# EAGLE design MBC5_1-4 (EAGLE 9.6.2)
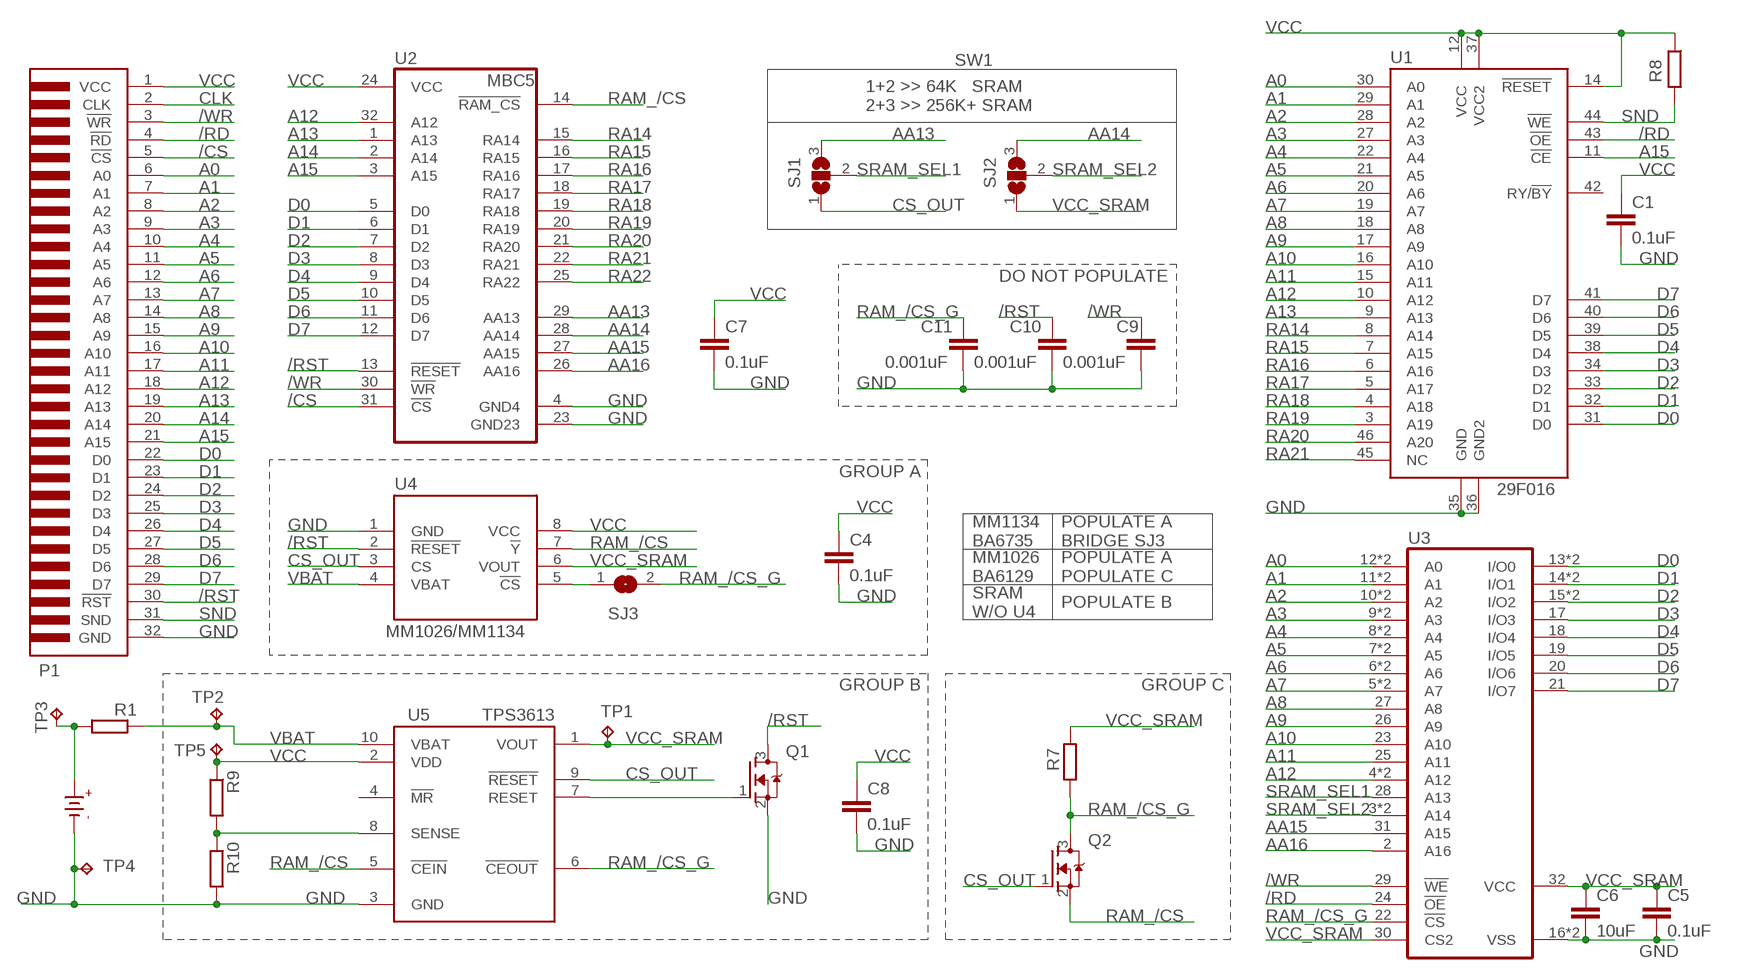
[diagram p0: schematic, sheet 1]

## Parts
B1  CR2025  [CR2025]
C1  0.1uF  C-EUC0603  [C0603]
C4  0.1uF  C-EUC0603  [C0603]
C5  0.1uF  C-EUC0603  [C0603]
C6  10uF  C-EUC0603  [C0603]
C7  0.1uF  C-EUC0603  [C0603]
C8  0.1uF  C-EUC0603  [C0603]
C9  0.001uF  C-EUC0603  [C0603]
C10  0.001uF  C-EUC0603  [C0603]
C11  0.001uF  C-EUC0603  [C0603]
P1  GBC_CARTTAB  [GBC_CART_TABBED]
Q1  2N7002  MOSFET-NREFLOW  [SOT23]
Q2  2N7002  MOSFET-NREFLOW  [SOT23]
R1  RR0603  [R0603]
R7  RR0603  [R0603]
R8  RR0603  [R0603]
R9  RR0603  [R0603]
R10  RR0603  [R0603]
SJ1  SJ2W  [SJ_2]
SJ2  SJ2W  [SJ_2]
SJ3  SJ  [SJ]
TP1  TPB1,27  [B1,27]
TP2  TPB1,27  [B1,27]
TP3  TPB1,27  [B1,27]
TP4  TPB1,27  [B1,27]
TP5  TPB1,27  [B1,27]
U1  29F016  [TSOP-48]
U2  MBC5  [QFP-32]
U3  1008L  [SO32L_L]
U4  MM1134  [SOIC-8]
U5  TPS3613  [MSOP-10]

## Nets
/CS: P1.5(!CS) U2.31(!CS)
/RD: P1.4(!RD) U1.43(!OE) U3.24(!OE)
/RST: C10.1 P1.30(!RST) Q1.3(D) U2.13(!RESET) U4.2(!RESET)
/WR: C9.1 P1.3(!WR) U2.30(!WR) U3.29(!WE)
A0: P1.6(A0) U1.30(A0) U3.12(A0) U3.L12(A0)
A1: P1.7(A1) U1.29(A1) U3.11(A1) U3.L11(A1)
A2: P1.8(A2) U1.28(A2) U3.10(A2) U3.L10(A2)
A3: P1.9(A3) U1.27(A3) U3.9(A3) U3.L9(A3)
A4: P1.10(A4) U1.22(A4) U3.8(A4) U3.L8(A4)
A5: P1.11(A5) U1.21(A5) U3.7(A5) U3.L7(A5)
A6: P1.12(A6) U1.20(A6) U3.6(A6) U3.L6(A6)
A7: P1.13(A7) U1.19(A7) U3.5(A7) U3.L5(A7)
A8: P1.14(A8) U1.18(A8) U3.27(A8)
A9: P1.15(A9) U1.17(A9) U3.26(A9)
A10: P1.16(A10) U1.16(A10) U3.23(A10)
A11: P1.17(A11) U1.15(A11) U3.25(A11)
A12: P1.18(A12) U1.10(A12) U2.32(A12) U3.4(A12) U3.L4(A12)
A13: P1.19(A13) U1.9(A13) U2.1(A13)
A14: P1.20(A14) U2.2(A14)
A15: P1.21(A15) U1.11(!CE) U2.3(A15)
AA13: SJ1.3 U2.29(AA13)
AA14: SJ2.3 U2.28(AA14)
AA15: U2.27(AA15) U3.31(A15)
AA16: U2.26(AA16) U3.2(A16)
CLK: P1.2(CLK)
CS_OUT: Q2.1(G) SJ1.1 U4.3(CS) U5.9(!RESET)
D0: P1.22(D0) U1.31(D0) U2.5(D0) U3.13(I/O0) U3.L13(I/O0)
D1: P1.23(D1) U1.32(D1) U2.6(D1) U3.14(I/O1) U3.L14(I/O1)
D2: P1.24(D2) U1.33(D2) U2.7(D2) U3.15(I/O2) U3.L15(I/O2)
D3: P1.25(D3) U1.34(D3) U2.8(D3) U3.17(I/O3)
D4: P1.26(D4) U1.38(D4) U2.9(D4) U3.18(I/O4)
D5: P1.27(D5) U1.39(D5) U2.10(D5) U3.19(I/O5)
D6: P1.28(D6) U1.40(D6) U2.11(D6) U3.20(I/O6)
D7: P1.29(D7) U1.41(D7) U2.12(D7) U3.21(I/O7)
GND [GND]: B1.- C1.2 C4.2 C5.2 C6.2 C7.2 C8.2 C9.2 C10.2 C11.2 P1.32(GND) Q1.2(S) R10.2 TP4.TP U1.35(GND) U1.36(GND2) U2.4(GND4) U2.23(GND23) U3.16(VSS) U3.L16(VSS) U4.1(GND) U5.3(GND)
N$3 [VCC]: B1.+ R1.2 TP3.TP
N$4: SJ3.1 U4.5(!CS)
N$6: Q1.1(G) U5.7(RESET)
N$7: R9.2 R10.1 U5.8(SENSE)
RA14: U1.8(A14) U2.15(RA14)
RA15: U1.7(A15) U2.16(RA15)
RA16: U1.6(A16) U2.17(RA16)
RA17: U1.5(A17) U2.18(RA17)
RA18: U1.4(A18) U2.19(RA18)
RA19: U1.3(A19) U2.20(RA19)
RA20: U1.46(A20) U2.21(RA20)
RA21: U1.45(NC) U2.22(RA21)
RA22: U2.25(RA22)
RAM_/CS: Q2.2(S) U2.14(!RAM_CS) U4.7(!Y) U5.5(!CEIN)
RAM_/CS_G: C11.1 Q2.3(D) R7.1 SJ3.2 U3.22(!CS) U5.6(!CEOUT)
SND: P1.31(SND) R8.2 U1.44(!WE)
SRAM_SEL1: SJ1.2 U3.28(A13)
SRAM_SEL2: SJ2.2 U3.3(A14) U3.L3(A14)
VBAT [VCC]: R1.1 TP2.TP U4.4(VBAT) U5.10(VBAT)
VCC [VCC]: C1.1 C4.1 C7.1 C8.1 P1.1(VCC) R8.1 R9.1 TP5.TP U1.12(VCC) U1.14(!RESET) U1.37(VCC2) U2.24(VCC) U4.8(VCC) U5.2(VDD)
VCC_SRAM [VCC]: C5.1 C6.1 R7.2 SJ2.1 TP1.TP U3.30(CS2) U3.32(VCC) U4.6(VOUT) U5.1(VOUT)
Unconnected: U1.42(RY/!BY) U5.4(!MR)

## Notes on the sheet
- SW1
- 1+2 >> 64K   SRAM
  2+3 >> 256K+ SRAM
- DO NOT POPULATE
- GROUP A
- MM1134
  BA6735
- POPULATE A
  BRIDGE SJ3
- MM1026
  BA6129
- POPULATE A
  POPULATE C
- SRAM
  W/O U4
- POPULATE B
- MM1026/MM1134
- GROUP B | GROUP C

## Library data of the parts
B1 = gameboylib:CR2025
C1 C4-C11 = rcl:C-EU: CAPACITOR, European symbol; SPICEPREFIX: C
P1 = gameboylib:GBC_CART
Q1 Q2 = adafruit:MOSFET-N: N-Channel Mosfet 2N7002E - 60V 260mA SOT23 [Digikey: 2N7002ET1GOSTR-ND] - REEL BSH103 - 30V 850mA SOT23 [Digikey: 568-5013-1-ND]
R1 R7-R10 = eagle-ltspice:R: RESISTOR, European symbol; SPICEMODEL: NONE; SPICEPREFIX: R
SJ1 SJ2 = jumper:SJ2W: SMD solder JUMPER
SJ3 = jumper:SJ: SMD solder JUMPER
TP1-TP5 = testpad:TP: Test pad
U1 = gameboylib:29F016
U2 = gameboylib:MBC5: MBC5; OC_FARNELL: unknown; OC_NEWARK: unknown
U3 = gameboylib:1008L: MEMORY
U4 = gameboylib:MM1134
U5 = gameboylib:TPS3613

## Net classes
1 VCC: width 0.203 mm
2 GND: width 0.203 mm

## Board
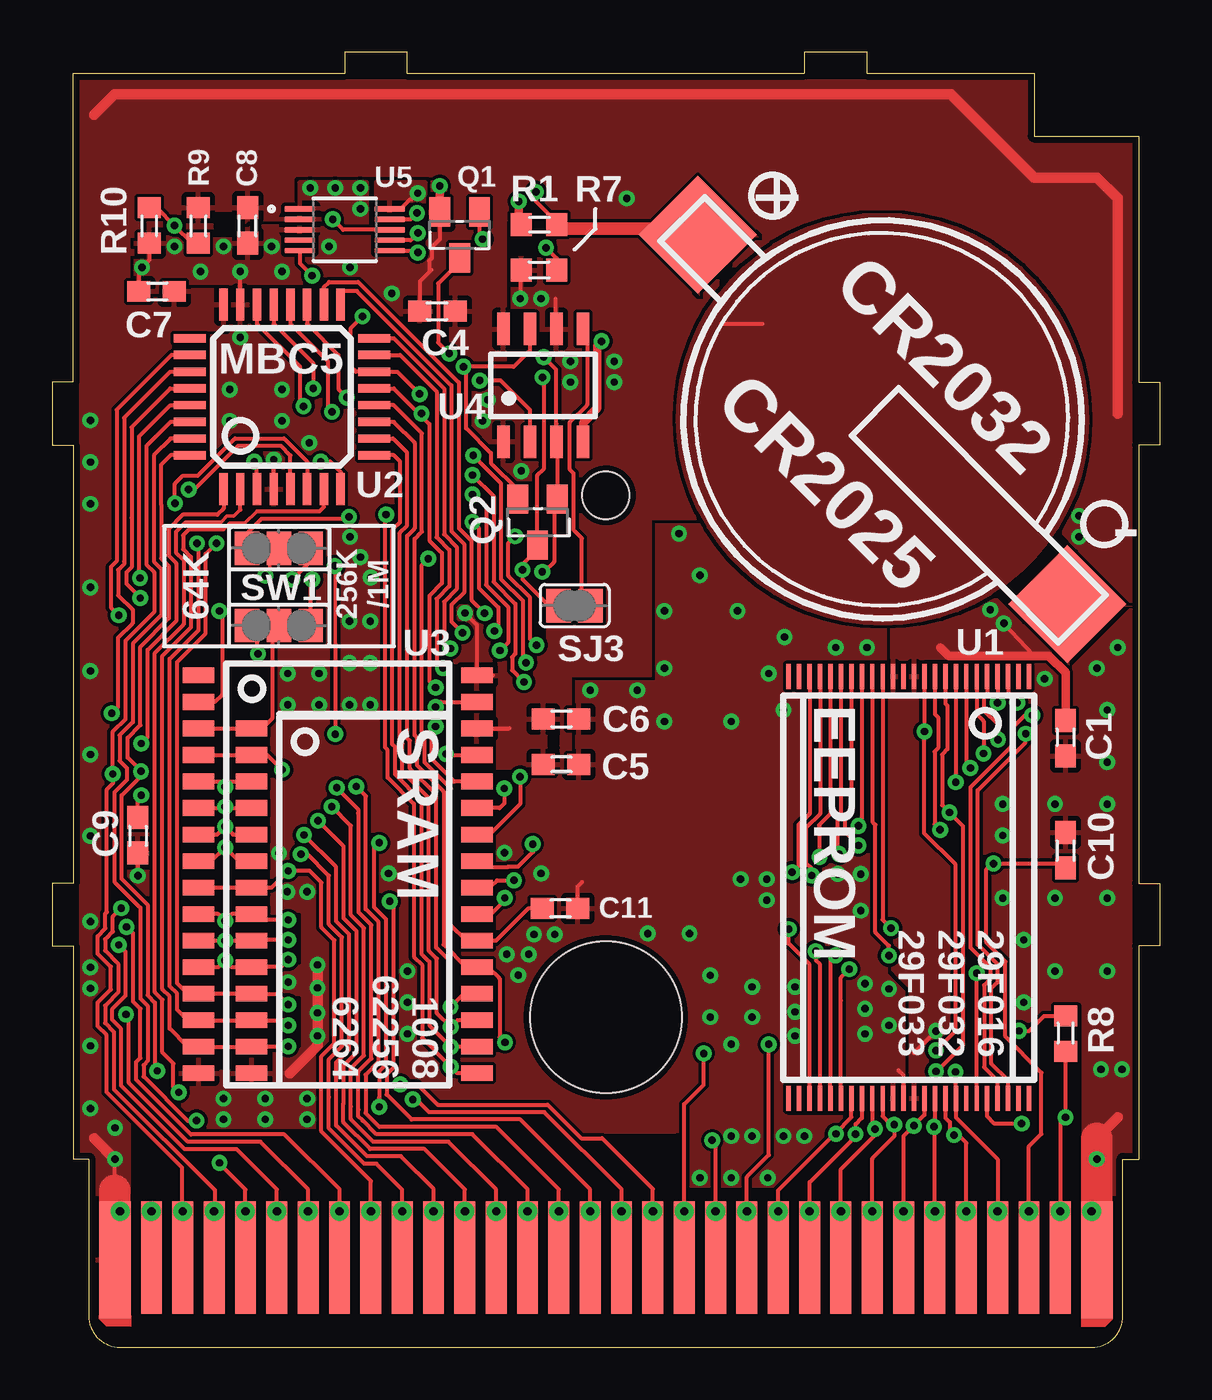
[diagram p1: board, top side]
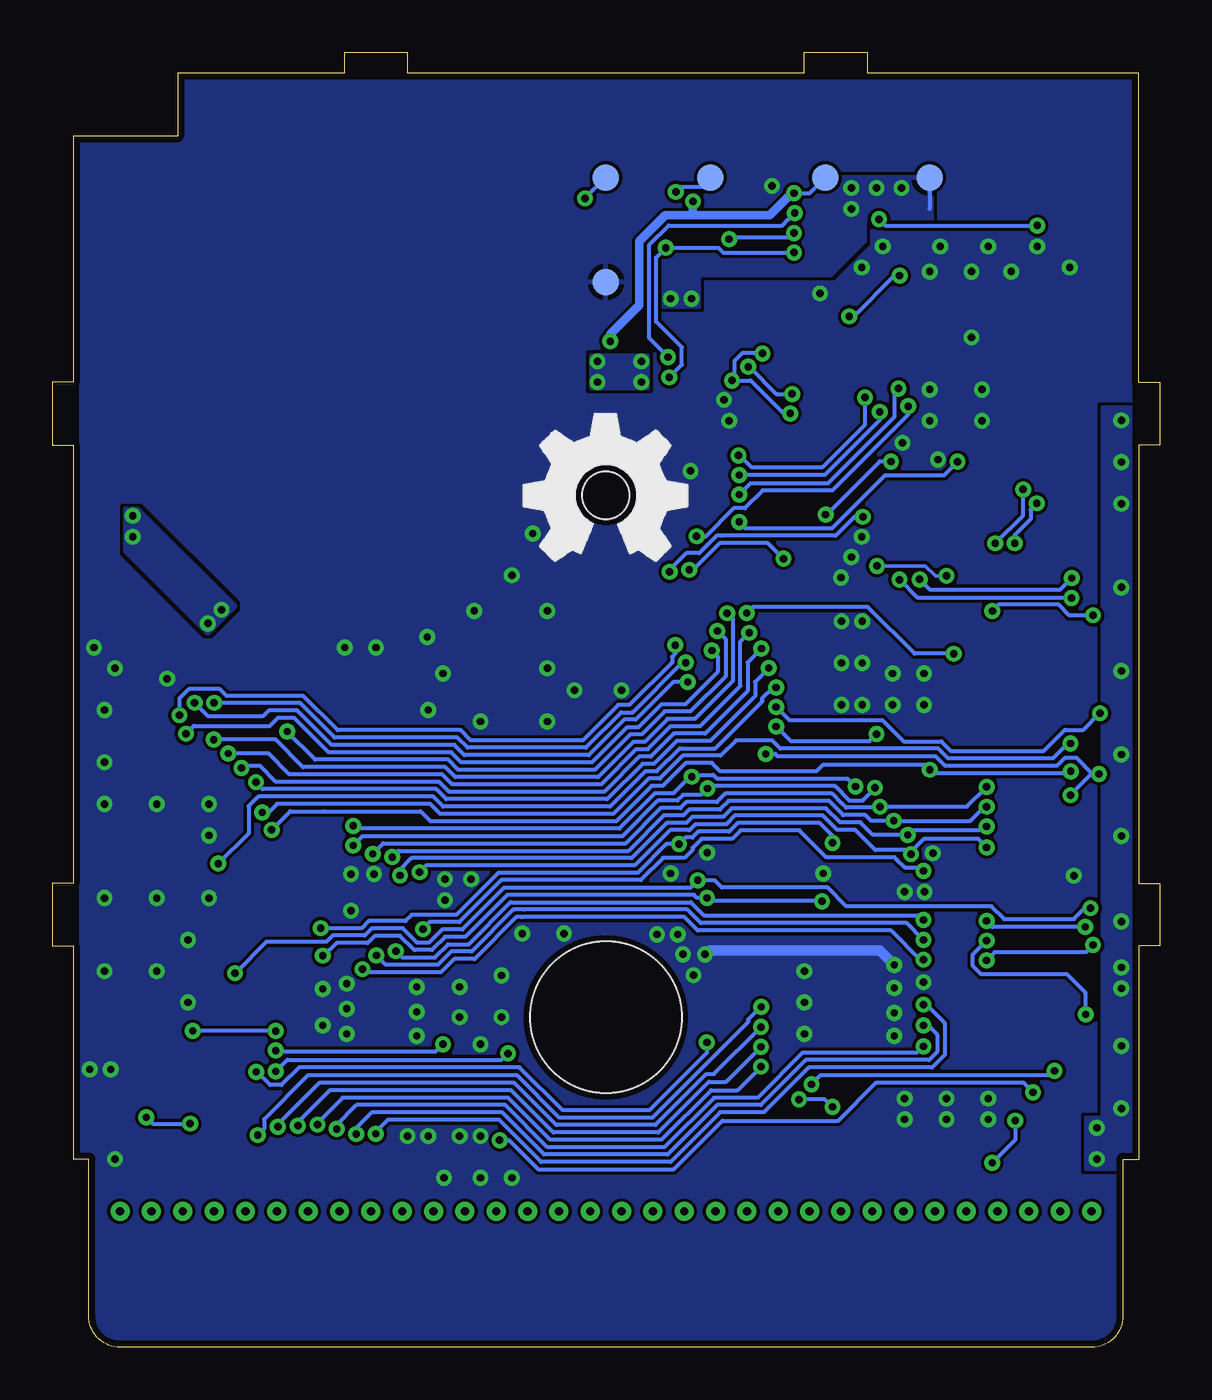
[diagram p2: board, bottom side, seen from below]

Size 53 x 62.01 mm. Coordinates in mm from the lower left corner, seen from the top.
Copper layers (1*16): Top 0.035mm / dielectric 1.5mm / Bottom 0.035mm
Design rules "default *": minimum track width 7mil, minimum drill 13mil, track to track 6mil, track to pad 7mil, pad to pad 7mil, via to via 7mil, smd to smd 5mil, copper to edge 12mil, drill to drill 22mil, minimum pad ring 10mil, minimum via ring 8mil, stop-mask expansion 4mil, vias tented up to drill 14mil, thermal gap 10mil
tKeepout: area -0.8,-1.6 to 55,11.5; area 0,11 to 3,62; area 50,11 to 53,62; area 3,55.1 to 50,62
tRestrict: area 29,6.7 to 34.9,7.6; area 3.9,3.5 to 49.1,7.6; area 11.2,14.4 to 11.8,16.7; area 35.1,11.9 to 40,12.6; area 35.2,32.5 to 39.8,32.8; area 47.6,0.7 to 50.9,1.2; area 41.7,32.5 to 46.8,32.8; area 9.3,50.4 to 12.7,50.8; area 7,42.9 to 7.5,48.4; area 9.9,21 to 10.3,29.4; area 10.1,13.5 to 10.4,14.2; area 8,13.4 to 8.6,13.8; area 19.4,29 to 19.9,32.5; area 20.8,30.2 to 21.1,31.8; area 20.5,23.6 to 21.1,29.2; area 20.8,19.8 to 21.1,20.4; area 22,49.2 to 23.1,49.6; area 35.2,11.2 to 44,11.7; area 48.5,4.6 to 49.1,16.4; area 3.9,7 to 4.5,11.1; area 26.1,9.7 to 29.9,10.2; area 22.8,48.1 to 23.9,48.5; area 11.2,9.9 to 12.8,10.3; area 11.2,18.4 to 11.8,20.7; area 10,17.2 to 10.6,17.9; area 22.2,52.4 to 22.6,52.8; area 7.8,53.3 to 8.6,54.3; area 17.4,48.5 to 17.9,48.9; area 23.1,34.1 to 23.6,34.5; area 23.8,28.7 to 24.2,29.4; area 16.9,54.4 to 17.1,54.5; area 40.5,11.8 to 40.5,12.1; area 45.3,34.7 to 49,38.9; area 10.9,60.8 to 42.9,61.3; area 0.7,15 to 1.2,47; area 51.8,14.7 to 52.3,46.7
bRestrict: area 51.8,14.7 to 52.3,46.7; area 0.7,15 to 1.2,47; area 10.9,60.8 to 42.9,61.3

### Footprints (pad centres in the part's own frame; a part is rotated, then mirrored left to right if it is on the bottom)
CR2025 = smd 4 x 4: + -12,0; - 13,0
C0603 = smd 1.1 x 1: 1 -0.85,0; 2 0.85,0
GBC_CART_TABBED = smd 1.5 x 5.6: 1 -23.4,-25.01; 32 23.6,-25.01 | smd 1 x 5.4: 2 -21.65,-24.91; 3 -20.15,-24.91; 4 -18.65,-24.91; 5 -17.15,-24.91; 6 -15.65,-24.91; 7 -14.15,-24.91; 8 -12.65,-24.91; 9 -11.15,-24.91; 10 -9.65,-24.91; 11 -8.15,-24.91; 12 -6.65,-24.91; 13 -5.15,-24.91; 14 -3.65,-24.91; 15 -2.15,-24.91; 16 -0.65,-24.91; 17 0.85,-24.91; 18 2.35,-24.91; 19 3.85,-24.91; 20 5.35,-24.91; 21 6.85,-24.91; 22 8.35,-24.91; 23 9.85,-24.91; 24 11.35,-24.91; 25 12.85,-24.91; 26 14.35,-24.91; 27 15.85,-24.91; 28 17.35,-24.91; 29 18.85,-24.91; 30 20.35,-24.91; 31 21.85,-24.91 | drill 0.4: P$1 -21.65,-22.7; P$2 -18.65,-22.7; P$3 -15.65,-22.7; P$4 -12.65,-22.7; P$5 -9.65,-22.7; P$6 -6.65,-22.7; P$7 -3.65,-22.7; P$8 -0.65,-22.7; P$9 2.35,-22.7; P$10 5.35,-22.7; P$11 8.35,-22.7; P$12 11.35,-22.7; P$13 14.35,-22.7; P$14 17.35,-22.7; P$15 20.35,-22.7; P$16 23.35,-22.7; P$17 21.85,-22.7; P$18 18.85,-22.7; P$19 15.85,-22.7; P$20 12.85,-22.7; P$21 9.85,-22.7; P$22 6.85,-22.7; P$23 3.85,-22.7; P$24 0.85,-22.7; P$25 -2.15,-22.7; P$26 -5.15,-22.7; P$27 -8.15,-22.7; P$28 -11.15,-22.7; P$29 -14.15,-22.7; P$30 -17.15,-22.7; P$31 -20.15,-22.7; P$32 -23.15,-22.7 | hole 7.25: 0.1,-13.41 | hole 2.25: 0.1,11.585
SOT23 = smd 1 x 1.4: 1 -0.95,-1.1; 2 0.95,-1.1; 3 0,1.1
R0603 = smd 1 x 1.1: 1 -0.85,0; 2 0.85,0
SJ_2 = smd 1.168 x 1.6: 1 -1.524,0; 2 0,0; 3 1.524,0
SJ = smd 1.168 x 1.6: 1 -0.762,0; 2 0.762,0
B1,27 = smd 1.27 x 1.27: TP 0,0
TSOP-48 = smd 1.2 x 0.21: 1 -10.1,5.75; 2 -10.1,5.25; 3 -10.1,4.75; 4 -10.1,4.25; 5 -10.1,3.75; 6 -10.1,3.25; 7 -10.1,2.75; 8 -10.1,2.25; 9 -10.1,1.75; 10 -10.1,1.25; 11 -10.1,0.75; 12 -10.1,0.25; 13 -10.1,-0.25; 14 -10.1,-0.75; 15 -10.1,-1.25; 16 -10.1,-1.75; 17 -10.1,-2.25; 18 -10.1,-2.75; 19 -10.1,-3.25; 20 -10.1,-3.75; 21 -10.1,-4.25; 22 -10.1,-4.75; 23 -10.1,-5.25; 24 -10.1,-5.75; 25 10.1,-5.75; 26 10.1,-5.25; 27 10.1,-4.75; 28 10.1,-4.25; 29 10.1,-3.75; 30 10.1,-3.25; 31 10.1,-2.75; 32 10.1,-2.25; 33 10.1,-1.75; 34 10.1,-1.25; 35 10.1,-0.75; 36 10.1,-0.25; 37 10.1,0.25; 38 10.1,0.75; 39 10.1,1.25; 40 10.1,1.75; 41 10.1,2.25; 42 10.1,2.75; 43 10.1,3.25; 44 10.1,3.75; 45 10.1,4.25; 46 10.1,4.75; 47 10.1,5.25; 48 10.1,5.75
QFP-32 = smd 0.4 x 1.524: 1 -2.8,-4.415; 2 -2,-4.415; 3 -1.2,-4.415; 4 -0.4,-4.415; 5 0.4,-4.415; 6 1.2,-4.415; 7 2,-4.415; 8 2.8,-4.415; 17 2.8,4.415; 18 2,4.415; 19 1.2,4.415; 20 0.4,4.415; 21 -0.4,4.415; 22 -1.2,4.415; 23 -2,4.415; 24 -2.8,4.415 | smd 1.524 x 0.4: 9 4.415,-2.8; 10 4.415,-2; 11 4.415,-1.2; 12 4.415,-0.4; 13 4.415,0.4; 14 4.415,1.2; 15 4.415,2; 16 4.415,2.8; 25 -4.415,2.8; 26 -4.415,2; 27 -4.415,1.2; 28 -4.415,0.4; 29 -4.415,-0.4; 30 -4.415,-1.2; 31 -4.415,-2; 32 -4.415,-2.8
SO32L_L = smd 0.75 x 1.5: 1 -10.16,-7.997; 2 -8.89,-7.997; 3 -7.62,-5.457; 4 -6.35,-5.457; 5 -5.08,-5.457; 6 -3.81,-5.457; 7 -2.54,-5.457; 8 -1.27,-5.457; 9 0,-5.457; 10 1.27,-5.457; 11 2.54,-5.457; 12 3.81,-5.457; 13 5.08,-5.457; 14 6.35,-5.457; 15 7.62,-5.457; 16 8.89,-5.457; 17 8.89,5.33; 18 7.62,5.33; 19 6.35,5.33; 20 5.08,5.33; 21 3.81,5.33; 22 2.54,5.33; 23 1.27,5.33; 24 0,5.33; 25 -1.27,5.33; 26 -2.54,5.33; 27 -3.81,5.33; 28 -5.08,5.33; 29 -6.35,5.33; 30 -7.62,5.33; 31 -8.89,5.33; 32 -10.16,5.33; L3 -7.62,-7.997; L4 -6.35,-7.997; L5 -5.08,-7.997; L6 -3.81,-7.997; L7 -2.54,-7.997; L8 -1.27,-7.997; L9 0,-7.997; L10 1.27,-7.997; L11 2.54,-7.997; L12 3.81,-7.997; L13 5.08,-7.997; L14 6.35,-7.997; L15 7.62,-7.997; L16 8.89,-7.997
SOIC-8 = smd 0.6 x 1.55: 1 1.905,2.7; 2 0.635,2.7; 3 -0.635,2.7; 4 -1.905,2.7; 5 -1.905,-2.7; 6 -0.635,-2.7; 7 0.635,-2.7; 8 1.905,-2.7
MSOP-10 = smd 1.47 x 0.28: 1 -2.15,1; 2 -2.15,0.5; 3 -2.15,0; 4 -2.15,-0.5; 5 -2.15,-1; 6 2.15,-1; 7 2.15,-0.5; 8 2.15,0; 9 2.15,0.5; 10 2.15,1

### Placement (x,y rotation side)
B1  39.39,44.79 315 top
C1  48.5,29.16 270 top
C4  18.45,49.61 180 top
C5  24.35,27.91 0 top
C6  24.35,30.09 0 top
C7  5,50.56 180 top
C8  9.35,53.71 270 top
C9  4.1,24.51 270 top
C10  48.5,23.81 90 top
C11  24.3,21.01 0 top
P1  26.4,29.21 0 top
Q1  19.5,53.26 180 top
Q2  23.23,39.51 180 top
R1  23.3,53.76 0 top
R7  23.3,51.59 180 top
R8  48.5,15.01 270 top
R9  7,53.71 270 top
R10  4.65,53.71 270 top
SJ1  10.85,38.26 0 top
SJ2  10.85,34.56 0 top
SJ3  25,35.51 180 top
TP1  11,56.01 0 bottom
TP2  16,56.01 0 bottom
TP3  21.5,56.01 0 bottom
TP4  26.5,51.01 0 bottom
TP5  26.5,56.01 0 bottom
U1  41,22.01 270 top
U2  11,45.51 0 top
U3  15,22.01 270 top
U4  23.5,46.06 180 top
U5  14,53.51 0 top

### Tracks (layer width: path | path; a pad name or v marks a point on that pad's centre or on a via)
/CS  (via drill 0.35)
  Top 0.2: 4.86,40.51 4.86,37.62 5.23,37.26 5.23,35.06 3.86,33.69 3.86,29.94 3.23,29.31 3.23,28.08 3.58,27.74 3.58,27.18 2.97,26.57 2.97,22.29 4.21,21.05 4.21,16.71 4.57,16.35 4.57,13.7 4.37,13.51 4.37,12.96 6.48,10.85 v6.91,10.85
  Top 0.203: U2.31 5.66,43.51 4.86,42.71 4.86,40.51 | P1.5 9.25,7.56 8.01,8.81 v8.01,8.83
  Bottom 0.2: v8.01,8.83 6.91,9.93 v6.91,10.85
/RD  (via drill 0.35)
  Top 0.2: U3.24 20.95,22.01 21.3,22.36 v22.1,22.36 | 7.78,7.56 7.78,7.54 | 7.78,7.54 7.78,4.03 P1.4 | v3.31,21.03 2.9,20.62 2.9,19.91 2.53,19.54 2.53,18.99 3.16,18.36 3.16,16.99 2.53,16.36 2.53,15.52 2.95,15.1 2.95,12.36 7.78,7.54
  Top 0.203: U1.43 44.25,13.26 44.25,17.48 v44.25,17.91
  Bottom 0.2: 22.05,22.41 v22.1,22.36 | v22.1,22.36 22.07,22.34 | v22.1,22.36 22.45,22.01 31.36,22.01 33.37,20.01 34.34,20.01 34.98,19.37 35.52,19.37 36.21,20.06 37.7,20.06 38.05,19.71 39.57,19.71 39.88,19.41 42.75,19.41 v44.25,17.91
  Bottom 0.203: v3.31,21.03 3.59,21.03 4.1,20.51 7.44,20.51 8.05,21.12 14.99,21.12 15.88,22.01 20.95,22.01 21.3,22.36 22.05,22.36 22.07,22.34
/RST  (via drill 0.35)
  Top 0.2: U2.13 16.35,45.91 17.55,44.71 | 17.55,44.71 18.05,44.21 18.05,38.64 18.66,38.03 18.66,36.59 18.05,35.98 18.05,31.9 v18.35,31.59 | C10.1 48.5,23.16 v45.05,23.16 | 17.55,44.71 v17.68,44.71 | v20.47,46.29 21.47,46.29 22.86,44.89 U4.2
  Top 0.203: v45.05,23.16 44.98,23.16 44.71,22.89 44.71,19.38 45.62,18.48 45.62,14.88 47.35,13.15 47.35,10.21 46.75,9.61 P1.30 | Q1.3 19.5,51.96 18.47,50.93 18.47,48.11 v19,47.58
  Bottom 0.2: v18.35,31.59 18.5,31.59 | 18.5,31.59 18.55,31.59 | v45.05,23.16 43.6,24.61 43.6,25.91 43.14,26.37 34.77,26.37 34.29,25.89 26.29,25.89 24.6,27.58 24.06,27.58 22.96,28.68 21.25,28.68 19.01,30.93 19.01,31.09 18.5,31.59 | v20.47,46.29 19.57,46.29 17.98,44.71 v17.68,44.71
  Bottom 0.203: v19,47.58 19.39,47.58 19.42,47.61 19.96,47.61 20.35,47.22 20.35,46.41 v20.47,46.29
/WR  (via drill 0.35)
  Top 0.2: v18.85,28.41 18.9,28.36 U3.29 | 6.2,4.05 6.2,8.61 2.6,12.21 2.6,14.95 2.17,15.38 2.17,16.5 2.8,17.13 2.8,18.22 2.17,18.85 2.17,19.68 2.55,20.06 2.55,20.77 2.62,20.84 2.62,26.72 2.9,27 v2.9,27.45 2.88,27.48 2.88,29.45 3.51,30.08 3.51,33.83 4.88,35.2 4.88,37.11 4.51,37.48 4.51,39.51 | C9.1 4.1,26.28 v4.26,26.44
  Top 0.203: U2.30 5.66,44.31 4.51,43.16 4.51,39.51 | P1.3 6.2,4.05
  Bottom 0.2: 18.85,28.36 v18.85,28.41 18.39,28.41 18.29,28.31 10.73,28.31 10.28,27.86 4.9,27.86 4.52,28.23 3.98,28.23 3.59,27.85 3.59,27.82 3.23,27.46 | v4.26,26.44 3.23,27.46 | v2.9,27.45 3.22,27.45 3.23,27.46
A0  (via drill 0.35)
  Top 0.2: P1.6 10.75,7.56 8.82,9.49 6.34,9.49 3.3,12.53 3.3,15.24 2.88,15.67 2.88,16.21 3.51,16.84 3.51,18.94 v3.18,19.26 3.15,19.24 | v11.3,18.56 10.95,18.21 9.55,18.21 U3.12 8.6,18.2 v8.28,18.53 7.95,18.2 U3.L12 | U1.30 37.75,16.6
  Top 0.203: v38.15,18.11 37.75,17.71 37.75,16.6
  Bottom 0.2: v8.28,18.53 7.89,18.91 3.54,18.91 v3.18,19.26 | 30.5,20.6 30.78,20.6 32.78,18.6 33.76,18.6 34.4,17.96 38,17.96
  Bottom 0.203: v11.3,18.56 11.45,18.56 12.84,19.95 22.1,19.95 22.75,20.6 30.5,20.6 30.53,20.6 | 38,17.96 v38.15,18.11
A1  (via drill 0.35)
  Top 0.2: v11.3,19.51 9.83,19.51 U3.11 v8.28,19.47 U3.L11 | P1.7 12.25,7.56 9.97,9.84 6.49,9.84 3.67,12.66 3.67,15.81 v3.53,15.94 | v37.49,18.77 37.24,18.53 37.24,12.88 37.25,12.88 U1.29
  Bottom 0.2: v3.53,15.94 3.53,16.96 4.44,17.87 8.55,17.87 8.93,18.25 8.93,18.81 v8.28,19.47 | 30.43,20.96 30.9,20.96 | 30.9,20.96 30.91,20.95 30.92,20.95 | 30.9,20.96 30.92,20.96 32.93,18.95 33.91,18.95 34.54,18.31 37.03,18.31 v37.49,18.77
  Bottom 0.203: v11.3,19.51 12.1,20.31 21.95,20.31 22.6,20.96 30.43,20.96
A2  (via drill 0.35)
  Top 0.2: v11.3,20.46 9.82,20.46 U3.10 8.6,20.74 v8.28,20.42 7.95,20.74 U3.L10 | v36.55,18.97 36.55,18.52 36.75,18.33 U1.28 | P1.8 13.75,7.56 11.12,10.19 6.63,10.19 4.02,12.81 4.02,13.66 4.21,13.85 4.21,16.21 3.86,16.56 3.86,19.82 v3.56,20.13
  Bottom 0.2: v11.3,20.46 11.53,20.69 21.81,20.69 22.43,21.31 31.07,21.31 33.08,19.3 34.05,19.3 34.69,18.66 36.25,18.66 v36.55,18.97 | v3.56,20.13 7.99,20.13 v8.28,20.42
A3  (via drill 0.35)
  Top 0.2: P1.9 15.25,7.97 12.88,10.33 12.88,13.93 13.51,14.55 13.51,19.49 12.89,20.11 12.89,22.25 12.32,22.81 v11.3,22.81 10.5,22.01 U3.9 U3.L9 | v35.25,20.03 35.25,19.33 36.25,18.33 U1.27
  Bottom 0.2: 12.57,23.35 12.68,23.46 15.95,23.46 17.24,24.75 20.05,24.75 20.45,24.34 21.92,24.34 22.34,23.92 22.34,23.82 22.73,23.44 23.76,23.44 24.83,22.37 31.5,22.37 33.51,20.36 34.92,20.36 v35.25,20.03
  Bottom 0.203: v11.3,22.81 11.44,22.95 12.17,22.95 12.57,23.35
A4  (via drill 0.35)
  Top 0.2: P1.10 16.75,7.55 15.51,8.79 14.93,8.79 13.24,10.48 13.24,11.97 13.24,13.79 13.86,14.41 13.86,19.63 13.24,20.25 13.24,22.57 12.2,23.61 v11.9,23.61 | U3.8 8.93,23.28 v8.28,23.94 7.62,23.28 U3.L8 | v35.42,22.75 35.72,23.05 35.72,25.01 36.25,25.55 U1.22
  Bottom 0.2: v8.28,23.94 8.7,24.36 11.25,24.36 11.9,23.71 v11.9,23.61 12.1,23.81 13.6,23.81 14.57,24.78 15.44,24.78 16.11,25.46 20.34,25.46 20.75,25.05 22.21,25.05 22.5,24.75 22.53,24.75 22.54,24.76 23.43,24.76 25.12,23.07 35.09,23.07 v35.42,22.75
A5  (via drill 0.35)
  Top 0.2: P1.11 18.25,7.59 16.69,9.14 15.07,9.14 13.59,10.63 13.59,11.82 13.59,13.64 14.21,14.26 14.21,19.78 13.59,20.4 13.59,23 v12.05,24.54 | U3.7 8.66,24.55 v8.28,24.94 7.89,24.55 U3.L7 | v36.35,22.59 36.35,22.92 36.07,23.2 36.07,24.87 36.75,25.55 U1.21
  Bottom 0.2: v8.28,24.94 8.45,24.76 11.82,24.76 v12.05,24.54 13.72,24.54 14.32,25.13 15.29,25.13 15.96,25.81 20.48,25.81 20.89,25.4 22.36,25.4 22.64,25.11 23.58,25.11 25.27,23.42 35.81,23.42 36.35,22.89 v36.35,22.59
A6  (via drill 0.35)
  Top 0.2: P1.12 19.75,7.56 17.81,9.5 15.22,9.5 13.94,10.77 13.94,11.68 13.94,13.49 14.56,14.12 14.56,19.92 13.94,20.55 13.94,23.99 v12.72,25.21 | v8.28,25.89 8.28,25.82 | 8.28,25.82 U3.6 | v36.73,23.47 36.7,23.5 36.7,25 37.25,25.55 U1.20 | U3.L6 8.28,25.82
  Bottom 0.2: v8.28,25.89 8.38,25.89 9.05,25.21 v12.72,25.21 13.8,25.21 14.07,25.49 15.14,25.49 15.56,25.9 15.82,26.16 20.63,26.16 21.04,25.75 22.51,25.75 22.79,25.47 23.72,25.47 25.41,23.78 36.42,23.78 v36.73,23.47
A7  (via drill 0.35)
  Top 0.2: 8.43,27.09 8.28,26.94 v8.28,26.84 | 8.43,27.09 U3.5 | v13.38,25.89 14.29,24.96 14.29,20.69 14.92,20.07 14.92,13.97 14.29,13.35 14.29,11.53 14.29,10.92 15.36,9.85 18.96,9.85 21.25,7.56 P1.13 | v37.66,23.62 37.59,23.7 37.59,25.39 37.75,25.55 U1.19 | U3.L5 8.43,27.09
  Bottom 0.2: v13.38,25.89 9.22,25.89 v8.28,26.84 | v13.38,25.89 13.44,25.82 | v37.66,23.62 37.16,24.13 25.56,24.13 23.87,25.82 22.94,25.82 22.65,26.1 21.18,26.1 20.77,26.51 15.67,26.51 15.2,26.05 15.2,26.04 15,25.84 13.42,25.84 v13.38,25.89
A8  (via drill 0.35)
  Top 0.2: P1.14 22.75,7.56 20.11,10.2 15.51,10.2 14.86,10.86 14.85,10.86 14.65,11.06 14.65,11.39 14.65,13.2 15.27,13.82 15.27,20.21 14.65,20.84 14.65,25.56 14.65,25.76 v13.62,26.79 | v38.59,24.03 37.94,24.69 37.94,25.24 38.25,25.55 U1.18 | 20.55,26.04 U3.27 21.41,25.82 21.64,26.05 v21.64,26.76
  Bottom 0.2: v38.59,24.03 38.15,24.48 25.7,24.48 24.02,26.17 23.08,26.17 22.8,26.46 21.94,26.46 v21.64,26.76 21.53,26.87 15.53,26.87 14.85,26.19
  Bottom 0.203: 14.85,26.19 14.21,26.19 v13.62,26.79
A9  (via drill 0.35)
  Top 0.2: P1.15 24.25,7.56 21.26,10.55 15.66,10.55 15,11.21 | U3.26 20.94,24.55 22.39,26 v22.39,27.32 | 15,11.24 15,13.06 15.62,13.68 15.62,20.36 15,20.98 15,26.01 | v38.59,24.97 38.75,25.12 U1.17
  Top 0.203: 15,25.71 15,26.01 15,26.37 15.02,26.39 v14.55,26.85 | 15,11.21 15,11.24
  Bottom 0.2: v38.59,24.97 38.46,24.83 25.85,24.83 24.16,26.52 23.26,26.52 22.46,27.32 v22.39,27.32 22.3,27.42 21.36,27.42 21.17,27.22 14.92,27.22
  Bottom 0.203: 14.92,27.22 v14.55,26.85
A10  (via drill 0.35)
  Top 0.2: P1.16 25.75,7.56 22.41,10.91 17.2,10.91 16,12.11 16,13.06 16.34,13.39 16.34,21.18 v16.16,21.35 | U3.23 20.09,20.75 21.02,20.75 | v40.05,18.75 40.05,19.22 39.4,19.87 39.4,25.01 39.25,25.16 U1.16
  Top 0.203: v21.66,21.52 21.66,21.4 21.02,20.75
  Bottom 0.2: v21.66,21.52 22.14,21.52 22.29,21.66 31.21,21.66 33.22,19.65 34.2,19.65 34.83,19.02 35.67,19.02 36.36,19.71 37.56,19.71 37.9,19.36 39.39,19.36 40,18.75 v40.05,18.75
  Bottom 0.203: v16.16,21.35 16.2,21.4 21.55,21.4 v21.66,21.52
A11  (via drill 0.35)
  Top 0.2: P1.17 27.25,7.56 23.55,11.26 18.04,11.26 17.39,11.9 17.31,11.82 v17.26,11.87 | v15.66,24.15 15.4,24.15 15.4,21.08 15.97,20.51 15.97,13.53 15.65,13.21 15.65,11.96 15.66,11.96 v15.66,11.51 | v40.15,20.07 39.75,20.46 U1.15 | 23,23.99 v23,24.09 23,23.72 22.3,23.02 21.83,23.02 21.82,23.01 20.6,23.01 U3.25
  Top 0.203: 20.58,23.03 U3.25
  Bottom 0.2: v15.66,11.51 16.01,11.87 v17.26,11.87 | v15.66,24.15 15.66,24.5 16.26,25.1 20.19,25.1 20.6,24.69 22.07,24.69 22.36,24.4 22.69,24.4 | 22.68,24.41 22.69,24.4 | 22.69,24.4 v23,24.09 23.6,24.09 24.98,22.72 31.65,22.72 33.66,20.71 35.8,20.71 36.1,20.41 37.85,20.41 38.19,20.07 v40.15,20.07
A12  (via drill 0.35)
  Top 0.2: P1.18 28.75,7.59 26.32,10.01 25.32,10.01 23.72,11.61 18.46,11.61 17.48,12.59 v16.66,12.59 | v11,27.65 10.29,28.36 U3.4 U3.L4 | 5.22,41.01 5.22,40.36 5.21,40.36 5.21,37.77 5.58,37.4 5.58,34.91 4.21,33.54 4.21,29.79 3.61,29.18 3.61,28.24 4.25,27.6 v4.25,27.58 4.25,27.35 3.32,26.43 3.32,22.44 4.57,21.19 4.57,16.85 4.92,16.5 4.92,13.35 v5.03,13.24 | v42.5,24.78 42.24,25.04 42.24,28.53 42.41,28.69 42.41,30.16 42.25,30.32 U1.10
  Top 0.203: U2.32 5.67,42.71 5.22,42.26 5.22,41.01
  Bottom 0.2: v16.66,12.59 16.21,13.04 5.23,13.04 v5.03,13.24 | 11.23,27.88 v11,27.65 10.85,27.5 4.32,27.5 v4.25,27.58 | 26,25.19 34.88,25.19 | v42.5,24.78 41.61,25.67 40,25.67 | 16.25,27.76 16.44,27.57 21.02,27.57 21.43,27.98 22.67,27.98 23.77,26.88
  Bottom 0.203: 11.23,27.88 16.13,27.88 16.25,27.76 16.33,27.68 | 23.77,26.88 24.31,26.88 26,25.19 | 34.88,25.19 35.36,25.67 40,25.67
A13  (via drill 0.35)
  Top 0.2: P1.19 30.25,11.63 31.18,12.57 v31.18,14.07 | v42.3,13.21 42.33,13.21 43.49,14.37 43.56,14.45 | U2.1 8.2,40.16 7.9,39.86 6.25,39.86 5.57,39.18 5.57,37.92 5.93,37.55 5.93,34.76 4.57,33.39 4.57,29.22 v4.26,28.91 | 43.59,14.48 43.59,24.96 v42.94,25.61 42.59,25.96 42.59,28.38 42.85,28.64 42.85,30.72 42.75,30.82 U1.9
  Top 0.203: 43.59,14.48 43.56,14.45
  Bottom 0.2: v31.18,14.07 31.49,13.76 41.75,13.76 v42.3,13.21 | v42.94,25.61 42.64,25.61 42.23,26.02 34.92,26.02 34.44,25.54 26.14,25.54 24.45,27.23 23.91,27.23 22.81,28.33 21.01,28.33 20.27,29.07 18.55,29.07 18.14,28.66 10.58,28.66 10.13,28.21 5.09,28.21 4.39,28.91 v4.26,28.91
A14  (via drill 0.35)
  Top 0.178: 6.4,39.51 6.41,39.52 8.09,39.52 8.36,39.79 8.68,39.79 9,40.11
  Top 0.2: 9,40.11 U2.2 | 6.4,39.51 5.92,39.03 5.92,38.06 6.29,37.69 6.29,34.62 4.92,33.25 4.92,17 5.27,16.64 5.27,14.12 5.8,13.59 5.8,12.46 v6.06,12.21
  Top 0.203: P1.20 31.75,9.75 v31.59,9.92
  Bottom 0.2: 13.55,12.68 6.53,12.68 v6.06,12.21
  Bottom 0.203: 13.55,12.68 15.38,10.85 20.93,10.85 23.26,8.52 29.74,8.52 31.13,9.92 v31.59,9.92
A15  (via drill 0.35)
  Top 0.2: P1.21 33.25,8.16 34.3,9.21 v34.3,14.51 | v20.11,39.52 20.42,39.21 20.42,36.36 21.35,35.42 21.35,34.48 v21.17,34.3 v21.16,34.3 | 43.24,21.47 43.24,23.11 41.75,24.6 v41.75,29.48 U1.11
  Top 0.203: U2.3 9.8,42.27 v9.67,42.4 | v42.3,14.21 43.24,15.15 43.24,21.47
  Bottom 0.2: v42.3,14.21 42.3,14.16 34.65,14.16 v34.3,14.51 | v20.11,39.52 19.81,39.22 15.67,39.22 | v21.16,34.3 20.77,33.9 20.77,32.12 22.45,30.45 23.69,30.45 24.79,29.35 25.33,29.35 27.02,27.65 33.56,27.65 34.04,28.14 40.42,28.14 41.75,29.46 v41.75,29.48
  Bottom 0.203: 15.67,39.22 13.15,41.74 10.32,41.74 v9.67,42.4
AA13  (via drill 0.35)
  Top 0.203: v4.2,36.84 4.15,36.89 4.15,43.61 5.65,45.11 U2.29 | SJ1.3 12.37,37.66 v11.48,36.77
  Bottom 0.203: v4.2,36.84 4.75,36.28 11,36.28 v11.48,36.77
AA14  (via drill 0.35)
  Top 0.2: 12.36,34.57 SJ2.3 | 3.79,44.06 3.79,39.72 3.8,39.71 3.8,37.36 3.54,37.11 3.54,36.56 4.21,35.89 v4.21,35.87
  Top 0.203: SJ2.3 12.37,36.69 v12.44,36.75 | 3.79,44.06 5.65,45.91 U2.28
  Bottom 0.203: v12.44,36.75 11.6,35.91 4.25,35.91 v4.21,35.87
AA15  (via drill 0.35)
  Top 0.2: 3.44,37.63 3.44,37.5 3.16,37.22 3.16,36 3.84,35.32 3.84,34.67 3.16,33.98 3.16,30.66 3.15,30.66 v2.85,30.36
  Top 0.203: U2.27 5.64,46.71 3.44,44.5 3.44,37.63 | v18.35,30.66 18.59,30.9 U3.31
  Bottom 0.2: 17.85,30.16 17.72,30.03 13.26,30.03 12.25,29.02 10.44,29.02 9.98,28.56 5.54,28.56 4.53,29.57 3.64,29.57 v2.85,30.36
  Bottom 0.203: v18.35,30.66 17.85,30.16
AA16  (via drill 0.35)
  Top 0.2: U2.26 5.7,47.51 3.08,44.89 3.08,37.64 2.8,37.36 2.8,35.43 v3.19,35.05 | U3.2 7.79,30.9 8.13,31.24 8.13,35.12 v8,35.25
  Bottom 0.2: v3.19,35.05 4.31,35.05 4.82,35.55 7.7,35.55 v8,35.25
CS_OUT  (via drill 0.35)
  Top 0.2: U4.3 24.25,43.25 | U4.3 24.18,43.32 Q2.1 24.02,40.46 24.02,37.61 23.55,37.14 v23.45,37.14 | v17.46,54.31 17.16,54.01 U5.9 | U4.3 24.14,44.23 24.12,44.24 24.12,46.81 v23.52,47.41
  Top 0.203: SJ1.1 9.33,38.99 10.01,39.67 14.11,39.67 v14.2,39.76
  Bottom 0.2: v23.52,47.41 24.45,48.34 24.45,52.76 23.49,53.72 18.06,53.72 17.77,54.01 17.76,54.01 v17.46,54.31 | 20.95,38.86 21.2,38.86 22.03,38.02 22.66,38.02 23.45,37.23 v23.45,37.14
  Bottom 0.203: v14.2,39.76 14.6,39.76 15.5,38.86 20.95,38.86
D0  (via drill 0.35)
  Top 0.2: v11.3,16.41 10.78,16.93 U3.13 U3.L13 6.48,16.93 5.97,17.44 5.97,32.81 7.34,34.18 7.34,37.98 v7.86,38.5 | 34.75,5.05 P1.22 34.75,7.51 37.46,10.22 v37.52,10.22 37.52,10.28 38.25,11.01 | U2.5 11.4,42.71 10.95,43.16 8.89,43.16 6.8,41.08 v6.53,41.08
  Top 0.203: U3.13 8.95,16.93 | 38.25,11.01 U1.31
  Bottom 0.2: v11.3,16.41 11.17,16.41 10.29,15.53 10.29,13.99 10.88,13.4 16.78,13.4 18.94,11.25 21.03,11.25 23.4,8.88 29.6,8.88 31.61,10.9 36.94,10.9 37.52,10.32 v37.52,10.22 | v6.53,41.08 6.53,39.83 v7.86,38.5
D1  (via drill 0.35)
  Top 0.2: v11.3,15.41 11.05,15.66 U3.14 U3.L14 | 36.25,5.32 P1.23 36.25,7.91 38.45,10.11 v38.45,10.21 38.45,10.69 38.75,10.99 | v5.87,40.41 5.87,41.36 6.25,41.73 6.96,41.73 8.74,43.51 11.1,43.51 12.2,42.41 U2.6 | 38.75,11.21 38.75,11.01 | v6.93,38.5 6.99,38.43 6.99,34.33 5.62,32.96 5.62,17.29 5.97,16.94 5.97,16.16 6.47,15.66 U3.L14 | 6.5,15.66 U3.L14
  Top 0.203: U3.14 9.09,15.66 | U1.32 38.75,11.01 38.75,10.99
  Bottom 0.2: v11.3,15.41 11.07,15.41 10.64,14.98 10.64,14.14 11.03,13.75 16.93,13.75 19.08,11.6 21.18,11.6 23.55,9.23 29.45,9.23 31.47,11.25 37.71,11.25 38.45,10.51 v38.45,10.21 | v6.93,38.5 6.93,38.9 6.17,39.65 6.17,40.11 v5.87,40.41
D2  (via drill 0.35)
  Top 0.178: 9.81,40.02 9.79,40.02 9.22,39.46 8.5,39.46 8.2,39.16
  Top 0.2: v11.3,14.41 11.28,14.39 U3.15 U3.L15 | 8.2,39.16 6.54,39.16 6.27,38.88 6.27,38.21 6.64,37.84 6.64,34.47 5.27,33.1 5.27,17.14 5.62,16.79 5.62,15.26 6.5,14.39 U3.L15 | U2.7 13,40.24 12.78,40.02 9.81,40.02 | 39.25,10.59 v39.38,10.45 39.31,10.38 39.31,10.09 37.75,8.53 P1.24 | U3.L15 6.45,14.39
  Top 0.203: U3.15 8.92,14.39 | U1.33 39.25,10.59
  Bottom 0.2: v11.3,14.41 11.6,14.11 17.07,14.11 19.23,11.95 21.32,11.95 23.7,9.58 29.3,9.58 31.32,11.6 38.44,11.6 39.38,10.65 v39.38,10.45
D3  (via drill 0.35)
  Top 0.2: U3.17 19.39,13.12 v19.07,13.44 17.7,14.81 17.7,18.31 17.31,18.7 17.31,26.03 16.06,27.28 16.06,28.6 15.93,28.72 15.93,39.83 v15.98,39.88 | v12.86,42.41 13.3,42.41 13.8,41.91 U2.8 | P1.25 39.25,9.04 40.3,10.09 v40.3,10.66 40.15,10.66 39.75,11.06
  Top 0.203: U1.34 39.75,11.06
  Bottom 0.2: v19.07,13.44 20.2,12.31 21.47,12.31 23.84,9.94 29.16,9.94 31.18,11.95 39.1,11.95 40.3,10.75 v40.3,10.66 | v15.98,39.88 15.93,39.88 13.39,42.41 v12.86,42.41
D4  (via drill 0.35)
  Top 0.2: U3.18 v19.08,14.39 | v19.08,14.39 v19.07,14.39 | U2.9 16.35,42.71 16.64,42.42 16.64,39.5 16.29,39.14 16.29,28.87 16.41,28.75 16.41,27.43 17.67,26.17 17.67,19.51 | 17.67,19.51 17.67,19.34 | 41.75,11.12 v41.24,10.61 40.75,10.12 P1.26 | 17.67,19.51 17.67,18.84 18.06,18.46 18.06,15.41 v19.08,14.39
  Top 0.203: U1.38 41.75,11.12
  Bottom 0.2: v19.07,14.39 20.75,12.71 21.57,12.71 23.99,10.29 29.01,10.29 31.03,12.31 39.7,12.31 41.24,10.77 v41.24,10.61
D5  (via drill 0.35)
  Top 0.2: U3.19 19.4,15.66 v19.07,15.34 18.41,16 18.41,18.6 18.02,18.99 18.02,26.31 16.76,27.57 16.76,28.89 16.64,29.02 16.64,39 16.99,39.35 16.99,42.84 16.32,43.51 U2.10 | 42.25,10.61 v42.2,10.56 42.25,10.51 P1.27
  Top 0.203: U1.39 42.25,10.61
  Bottom 0.2: v19.07,15.34 21.32,13.09 21.69,13.09 24.13,10.64 28.87,10.64 30.88,12.66 40.23,12.66 42.05,10.83 42.05,10.71 v42.2,10.56
D6  (via drill 0.35)
  Top 0.2: U3.20 19.7,16.93 v19.06,16.3 19.06,18.45 18.38,19.14 18.38,26.46 17.12,27.72 17.12,29.04 16.99,29.16 16.99,38.85 17.34,39.2 17.34,43.32 16.35,44.31 U2.11 | 42.75,10.98 42.96,10.77 42.96,10.36 v43.16,10.16 43.36,10.17 43.75,9.78 P1.28
  Top 0.203: U1.40 42.75,10.98
  Bottom 0.2: v19.06,16.3 19.09,16.3 19.69,15.7 19.69,15.58 24.28,10.99 28.72,10.99 30.74,13.01 40.77,13.01 42.86,10.92 42.86,10.46 v43.16,10.16
D7  (via drill 0.35)
  Top 0.2: 45.23,4.92 45.25,4.9 P1.29 45.25,9.01 43.25,11.01 | v21.67,14.6 21.42,14.85 21.42,17.65 20.87,18.2 U3.21 19.81,18.2 18.73,19.29 18.73,26.61 17.47,27.87 17.47,29.18 17.34,29.31 17.34,38.7 17.7,39.06 17.7,43.76 16.35,45.11 U2.12 | 43.25,13.17 v43.23,13.19
  Top 0.203: 43.25,11.01 U1.41 43.25,13.17
  Bottom 0.2: v21.67,14.6 21.67,14.1 24.43,11.35 28.57,11.35 30.64,13.41 41.17,13.41 42.03,12.55 42.57,12.55 43.21,13.19 v43.23,13.19
GND  (via drill 0.35)
  Top 0.203: C9.2 v4.1,22.59 | U2.4 v10.6,42.5 | C7.2 4.15,51.56 v4.3,51.71 4.65,52.06 R10.2 | 9,52.41 8.95,52.46 C8.2 | C4.2 17.6,51.03 18.04,51.47 | C11.2 25.15,22.06 25.35,22.26 | 18.15,51.59 18.04,51.47 | Q1.2 18.55,53.06 18.16,52.67 18.16,52.14 18.04,52.03 18.04,51.47 | U2.23 v9,51.51 | U1.36 40.75,13.01 40.5,13.26
  Top 0.4: U4.1 21.5,43.45 | Q1.2 v18.55,55.61
  Top 0.5: 50,10.01 51,11.01 | v12.7,18.31 12.7,14.46 11.36,13.12
  Top 1.5: P1.32 50,10.01
  Bottom 0.203: 21.5,19.01 21.56,19.01 v21.76,18.82
  Bottom 0.5: v12.7,18.31 13.4,19.01 21.5,19.01
  other vias: 12.7,17.21 12.7,16.01 12.7,14.91 10.2,11.91 31.5,17.81 31.5,15.81 33.5,15.81 51.2,13.31 50,9.01 50.2,13.31 38.9,16.21 38.9,17.41 24.06,19.77 32.5,14.51 50.5,28.01 48,21.51 50.5,21.51 35,30.51 9,48.36 8.5,45.86 11,45.86 11,44.36 14.25,38.81 14.22,34.76 10.85,23.66 46.5,16.51 45.5,21.51 48,18.01 50.5,18.01 12.3,43.31 22.81,18.82 23.06,19.77 22.31,17.82 31,8.11 20.85,45.36 32.5,8.11 34.25,8.11 32.5,10.11 33.5,10.11 35,10.11 36,10.11 39,33.51 37.5,33.51 37.6,22.66 38.7,22.66 40.05,17.16 40.05,15.41 38.9,15.01 35.55,14.91 35.55,17.26 35.55,16.06 33.5,17.26 28.5,19.81 45.5,24.51 45.5,26.01 48,26.01 50.5,26.01 50,32.51 51,33.51 8.5,44.36 22.45,41.96 8.2,11.91 8.2,10.91 12.2,21.81 11.25,21.81 16.1,22.69 17,18.01 17,16.51 17,15.01 10.2,10.91 12.2,10.91 12.2,11.91 14.75,37.84 15.25,36.86 11.3,17.49 50.5,30.51 12.78,32.26 11.28,32.26 11.28,30.76 12.78,30.76 15.22,34.76 14.22,32.76 15.22,32.76 14.22,30.76 15.22,30.76 5.85,52.71 7.1,51.51 8.2,52.71 10.5,52.71 11,51.51 13.25,52.71 14.25,51.71 16.25,50.46 20.6,44.36 32.95,22.41 34.2,22.41 34.2,21.41 38.7,20.91 30.5,19.81 46.5,19.51 29.3,32.51 30,38.96 29.3,35.26 29.3,29.96 32.5,29.96 32.8,35.26 35.05,34.01 34.3,32.26 28,31.46 21.65,23.69 25.75,31.46 23.4,22.69 47.5,32.01 31,36.96
  pour Top (rank 6): -2,63.01 56.5,63.01 56.5,6.51 -4,6.51 -4,61.01
  pour Bottom (rank 6): -0.5,62.01 57,62.01 57,-2.49 0,-2.49 0,61.01 -0.5,61.51
  pour Top: 39.85,32.91 39.85,34.11 36.5,34.11 36.5,32.91
  pour Top: 4,50.51 4,53.56 10.55,53.56 10.5,53.51 10.5,50.96 5,50.96 5,50.51
N$3  (via drill 0.35)
  Top 0.203: R1.2 24.15,53.87 23.15,54.87 v23.15,55.32 | 32,49.01 34,49.01 | B1.+ 30.5,53.68 30.5,54.01
  Top 0.5: 30.5,54.01 30.05,53.56
  Top 0.6: R1.2 24.35,53.56 30.05,53.56
  Bottom 0.203: TP3.TP 21.5,55.57 22.9,55.57 v23.15,55.32
  pour Top: 29.95,44.46 arc-90 39.72,54.24 arc-90 49.55,44.41 arc-90 39.77,34.64 arc-90
  pour Top: 29.85,54.76 29.85,51.64 31.65,49.84 32.5,49.84 34.3,51.64 34.3,52.56 32.1,54.76
N$4
  Top 0.2: SJ3.1 25.35,35.92 25.35,38.74 24.95,39.14 24.95,41.84 24.78,42.02 24.78,44.3 25.61,45.12 25.61,48.56 U4.5
N$6  (via drill 0.35)
  Top 0.203: Q1.1 20.45,53.21 v20.6,53.06 | v17.5,53.35 17.16,53.01 U5.7
  Bottom 0.203: v20.6,53.06 20.51,53.15 17.7,53.15 v17.5,53.35
N$7  (via drill 0.35)
  Top 0.2: U5.8 13.93,53.51 v13.43,54.01 | R9.2 6.7,52.86 v5.85,53.71 5,54.56 R10.1
  Bottom 0.2: v13.43,54.01 13.12,53.71 v5.85,53.71
RA14  (via drill 0.35)
  Top 0.2: U2.15 16.65,47.51 18.4,45.76 18.4,38.78 19.01,38.18 19.01,36.44 18.4,35.84 18.4,32.83 v18.7,32.53 | v43.25,27.06 U1.8
  Bottom 0.2: v18.7,32.53 v18.7,32.52 19.36,31.86 19.36,31.17 21.5,29.04 23.1,29.04 24.2,27.94 24.75,27.94 26.44,26.25 34.14,26.25 34.63,26.73 42.94,26.73 43.25,27.04 v43.25,27.06
RA15  (via drill 0.35)
  Top 0.2: U2.16 16.35,48.31 18.75,45.91 18.75,38.93 19.36,38.32 19.36,36.3 18.75,35.69 18.75,33.77 v19.06,33.46 | 43.75,32.01 U1.7 43.75,27.93 v43.95,27.74 43.75,27.74
  Bottom 0.2: v19.06,33.46 v19.06,33.45 19.71,32.8 19.71,31.42 21.75,29.39 23.25,29.39 24.35,28.29 24.89,28.29 26.58,26.6 34,26.6 34.48,27.08 42.29,27.08 43.05,27.84 43.84,27.84 v43.95,27.74
RA16  (via drill 0.35)
  Top 0.2: U2.17 13.8,50.58 14.58,50.58 19.11,46.05 19.11,39.08 19.71,38.47 19.71,36.15 19.11,35.54 19.11,34.75 v19.64,34.21 | U1.6 44.24,31.51 44.24,30.32 44.58,29.98 v44.58,28.43
  Top 0.203: 44.25,32.01 U1.6 44.25,31.52 44.24,31.51
  Bottom 0.2: v19.64,34.21 20.07,33.79 20.07,31.67 21.99,29.74 23.4,29.74 24.5,28.64 25.04,28.64 26.73,26.95 33.85,26.95 34.33,27.43 41.65,27.43 42.64,28.43 v44.58,28.43
RA17  (via drill 0.35)
  Top 0.2: U2.18 13,50.76 13.25,51.01 14.65,51.01 19.46,46.2 19.46,39.22 20.07,38.62 20.07,35.78 v20.7,35.15 | v45.27,29.1 45.27,29.81 44.59,30.49 44.59,31.13 44.75,31.29 U1.5
  Bottom 0.2: v20.7,35.15 20.42,34.87 20.42,31.91 22.24,30.09 23.54,30.09 24.64,28.99 25.18,28.99 26.88,27.3 33.71,27.3 34.19,27.78 41,27.78 42.31,29.1 v45.27,29.1
RA18  (via drill 0.35)
  Top 0.2: U2.19 12.2,49 13.69,47.51 13.69,45.88 v14.1,45.48 | v20.15,42.7 21.48,41.37 21.48,36.79 22.52,35.74 22.52,32.94 v22.68,32.78 | U1.4 v45.25,30.86
  Bottom 0.2: v14.1,45.48 14.1,44.18 16.13,42.15 19.55,42.15 20.1,42.7 v20.15,42.7 | v22.68,32.78 22.68,32.76 | 22.68,32.76 22.68,32.75 | v45.25,30.86 45.23,30.84 41.13,30.84 39.48,29.19 33.6,29.19 33.12,28.71 27.46,28.71 25.77,30.4 25.23,30.4 22.87,32.76 22.68,32.76
RA19  (via drill 0.35)
  Top 0.2: U2.20 11.4,49.01 13.2,47.21 13.2,44.99 v13.39,44.79 | v20.11,41.76 21.12,40.75 21.12,36.65 22.17,35.6 22.17,33.21 22.01,33.05 22.01,32.42 v22.58,31.85 | v46.18,30.86 45.75,31.29 U1.3
  Bottom 0.2: v13.39,44.79 13.39,44.39 16.02,41.76 v20.11,41.76 | v46.18,30.86 45.52,30.2 42.93,30.2 42.64,30.49 41.28,30.49 39.63,28.84 33.75,28.84 33.27,28.36 27.31,28.36 25.62,30.05 25.08,30.05 23.28,31.85 v22.58,31.85
RA20  (via drill 0.35)
  Top 0.2: U2.21 10.6,49.01 12.49,47.12 v12.49,45.91 | v20.11,40.83 20.23,40.83 20.77,40.29 20.77,36.5 21.82,35.45 21.82,33.76 v21.43,33.36 | 45.75,12.78 44.95,13.58 44.95,17.19 45.26,17.49 45.26,18.33 44.3,19.29 44.3,26.66 46.6,28.96 v46.6,29.38
  Top 0.203: U1.46 45.75,12.78
  Bottom 0.2: v12.49,45.91 12.69,45.71 12.69,44.54 15.86,41.38 19.57,41.38 v20.11,40.83 | v21.43,33.36 21.12,33.06 21.12,32.36 22.68,30.8 23.83,30.8 24.93,29.7 25.48,29.7 27.17,28.01 33.41,28.01 33.9,28.49 39.78,28.49 41.42,30.14 42.2,30.14 42.58,29.75 46.22,29.75 v46.6,29.38
RA21  (via drill 0.35)
  Top 0.2: U2.22 9.8,49.01 11.84,46.97 11.84,45.25 v12.03,45.06 | v23.18,33.62 22.88,33.92 22.88,35.89 21.83,36.94 21.83,38.5 v22.16,38.83 | v46.91,30.26 46.56,30.26 46.33,30.03 46.32,30.03 45.93,29.64 45.93,28.79 43.95,26.81 43.95,19.14 44.91,18.18 44.91,17.64 44.6,17.34 44.6,13.41 45.25,12.76
  Top 0.203: U1.45 45.25,12.76 | 45.25,12.76 | 45.25,12.76
  Bottom 0.2: v12.03,45.06 12.03,44.66 15.66,41.02 18.99,41.02 19.84,40.17 20.39,40.17 21.73,38.83 v22.16,38.83 | v23.18,33.62 23.18,33.21 23.33,33.05 23.33,32.79 25.37,30.76 25.91,30.76 27.61,29.06 32.98,29.06 33.46,29.55 39.34,29.55 40.99,31.19 44.66,31.19 44.98,31.52 46.46,31.52 46.91,31.07 v46.91,30.26
RAM_/CS  (via drill 0.35)
  Top 0.2: v17.59,45.65 16.52,46.71 U2.14 14.55,46.71 14.3,46.96 14.3,48.81 v14.85,49.36 | 19.81,44 19.81,44.01 | 19.81,44.01 19.81,46.83 v19.69,46.95 22.09,46.95 22.86,47.73 U4.7 | 19.81,44.01 21,42.82 21,42.35 22.27,41.07 Q2.2 | v12.44,51.31 11.85,51.9 U5.5
  Bottom 0.2: v19.69,46.95 19.64,46.95 18.34,45.65 v17.59,45.65 | v14.85,49.36 14.64,49.36 12.69,51.31 v12.44,51.31
RAM_/CS_G  (via drill 0.35)
  Top 0.2: C11.1 22.78,21.01 21.23,19.46 21.23,19.47 U3.22 19.82,19.47 19.08,20.21 19.08,26.75 17.82,28.01 17.82,29.33 17.7,29.45 17.7,37.46 v18,37.76 | v23.47,46.45 23.52,46.39 23.52,42.05 23.23,41.75 Q2.3 | Q2.3 23.23,38.2 22.51,37.48 v22.51,37.23 22.51,36.78 23.77,35.51 SJ3.2 24.5,35.77 | v23.64,52.64 24.15,52.13 R7.1 | Q2.3 23.62,38.01
  Top 0.203: U5.6 17.41,52.51 v17.5,52.42
  Bottom 0.2: v18,37.76 18.75,38.51 21.05,38.51 22.33,37.23 v22.51,37.23 | v23.47,46.45 v23.46,46.45 22.87,47.04 22.87,47.88 24.09,49.11 24.09,52.19 v23.64,52.64
  Bottom 0.203: v23.64,52.64 21.11,52.64 20.87,52.4 17.52,52.4 v17.5,52.42
SND  (via drill 0.35)
  Top 0.2: 48.25,10.89 P1.31 | 44.75,11.06 45.1,10.71 v46.4,10.71
  Top 0.203: R8.2 v48.5,11.01 48.38,11.01 48.25,10.89 | 44.75,11.06 U1.44
  Bottom 0.2: v48.5,11.01 48.2,10.71 v46.4,10.71
SRAM_SEL1  (via drill 0.35)
  Top 0.178: SJ1.2 10.4,37.81 10.4,37.14 v10.2,36.94 | v13.52,37.41 13.55,37.39 13.55,33.66
  Top 0.2: U3.28 19.24,27.09 18.17,28.16 18.17,29.55 v18.35,29.73
  Top 0.203: SJ1.2 10.85,38.81 | 13.55,33.66 v13.55,29.36
  Bottom 0.178: v10.2,36.94 10.22,36.92 10.72,36.92 11.22,37.41 v13.52,37.41
  Bottom 0.2: v18.35,29.73 17.65,29.02 13.89,29.02 v13.55,29.36
SRAM_SEL2
  Top 0.2: SJ2.2 10.53,34.23 10.53,30.11 10.04,29.63 U3.3 U3.L3
VBAT  (via drill 0.35)
  Top 0.203: v17.49,55.26 17.2,54.97 17.14,54.97 16.68,54.51 U5.10
  Top 0.4: R1.1 22.4,53.76 | R1.1 22.5,53.71 | U4.4 25.41,44.28 26.09,44.97 26.09,47.97 v26.29,48.17 | 22.45,54.12 R1.1 | R1.1 22.33,53.88 v22.33,54.86
  Bottom 0.203: v17.49,55.26 16.75,55.26 TP2.TP
  Bottom 0.4: v26.29,48.17 26.29,48.52 24.9,49.91 24.9,52.96 23.65,54.21 22.35,54.21 | v17.49,55.26 17.59,55.26 18.65,54.21 22.35,54.21 | v22.33,54.86 22.35,54.84 22.35,54.21
  pour Top: 15.5,54.41 15.5,55.81 17.85,55.81 17.85,54.41
VCC  (via drill 0.35)
  Top 0.203: 48.29,15.86 R8.1 47.48,15.86 46.77,15.15 v46.27,15.15 | 41.25,14.09 v42.3,15.14 | 3,7.51 v3,9.01 | 47,33.11 v45.55,34.66
  Top 0.4: 27.76,59.95 27.7,60.01 | C1.1 48.5,32.31 47.7,33.11 47,33.11 42.9,33.11 42.5,33.51
  Top 0.5: v3,9.01 2,10.01 | 2,59.01 3,60.01 27.7,60.01 43,60.01 47,56.01 50,56.01 51,55.01 51,44.71
  Top 1.5: P1.1 3,7.51
  Bottom 0.203: v42.3,15.14 v46.27,15.14 v46.27,15.15 | TP5.TP v27.5,55.01
  other vias: 3,10.51 1.82,14.44 1.82,20.39 1.82,24.49 1.82,28.39 1.82,32.39 1.82,36.39 1.82,40.39 1.82,44.39 1.82,17.19 44.9,35.31 49.15,39.81 49.15,38.81 1.82,42.39 1.82,11.44 1.82,18.19
  pour Top (rank 2): 3.65,2.66 3.65,7.46 6.2,7.46 6.2,13.16 4.7,14.66 4.7,17.96 4.2,18.46 4.2,20.71 5.5,22.01 5.5,47.01 6,47.51 6,48.76 8.25,48.76 8.25,52.91 9.35,54.01 32.65,54.01 32.65,38.56 46.7,38.56 46.7,35.76 52.4,35.76 52.4,62.91 52.5,63.01 52.5,63.51 -0.5,63.51 -0.5,2.51 3.5,2.51
  pour Top (rank 2): 40.2,31.61 40.2,35.91 47.75,35.91 47.75,33.01 41.65,33.01 41.65,26.81 43.2,25.26 43.2,15.21 42.2,14.21 42.2,11.31 41.1,11.31 41.1,17.21 39.7,18.61 39.7,31.11
  pour Top (rank 2): 19.1,54.41 21.65,54.41 21.65,46.91 19.1,46.91
  pour Bottom: 0.5,8.51 3.5,8.51 3.5,11.01 2.73,11.01 2.73,45.01 0.5,45.01
  pour Bottom: 44.23,35.48 45.55,34.16 49.5,38.11 49.5,40.16 48.9,40.16
VCC_SRAM  (via drill 0.35)
  Top 0.203: SJ2.1 9.4,34.56 9.8,34.16 9.8,33.26 v9.85,33.21 | v19.76,35.15 20.33,34.59 U3.32 21.09,32.17 | U3.30 21.88,29.63 | U4.6 24.1,48.8 24.1,50.21 | R7.2 22.4,51.53 v22.4,50.21
  Bottom 0.203: v9.85,33.21 11.72,33.21 13.97,35.46 19.46,35.46 v19.76,35.15 | TP1.TP 11,54.51
  other vias: 23.4,50.21 12.35,55.51 13.55,55.51 14.75,55.51 14.75,54.51 24.8,47.21 24.8,46.21 26.9,46.21 26.9,47.21
  pour Top (rank 3): 25.5,41.16 24.7,41.16 24.6,41.06 23.45,41.06 23.45,40.11 23.43,38.31 23.98,38.31 23.98,35.46 18.85,35.46 18.85,33.36 18.25,32.76 18.25,27.76 24.8,27.76 24.8,32.19 25.5,32.19
  pour Top: 22.05,53.46 29.45,53.46 29.45,40.21 28.6,40.21 28.6,32.16 22.9,32.16 21.4,37.26 23.42,39.28 23.4,47.16 22.05,48.51
  pour Bottom: 10.9,56.06 10.9,53.96 14.1,53.96 14.1,52.96 15.75,51.31 22.05,51.31 22.05,49.81 24.1,49.81 24.1,53.11 24,53.21 18.55,53.21 17.8,53.96 17.8,55.21 16.5,55.21 16.5,56.06
  pour Top: 11.85,54.51 11.85,55.81 15.05,55.81 15.05,53.56 13.85,53.56 12.9,54.51
  pour Bottom: 24.5,45.91 27.2,45.91 27.2,47.51 24.5,47.51
  pour Top (rank 2): 26.56,39.7 31.85,39.7 31.85,52.11 26.2,52.11 26.2,40.06
  pour Top (rank 2): 26.56,39.7 29.5,39.71 29.5,39.96 30.75,39.96 31.01,39.7 31.85,39.7 31.85,52.11 26.2,52.11 26.2,40.06

### Text on the board
tPlace: 256K / /1M | 64K | SW1
tNames: + | MBC5 | CR2032 | U4 | CR2025 | - | EEPROM | SRAM | 29F016 / 29F032 / 29F033 | 1008 / 62256 / 6264
tStop: GAME BOY MBC5 CARTRIDGE | 1 | 32
bStop: v1.4 | SUPPORT ORIGINAL CREATORS! | www.mousebitelabs.com